# Altium project PCB_DC_Motor_Drive.PrjPCB
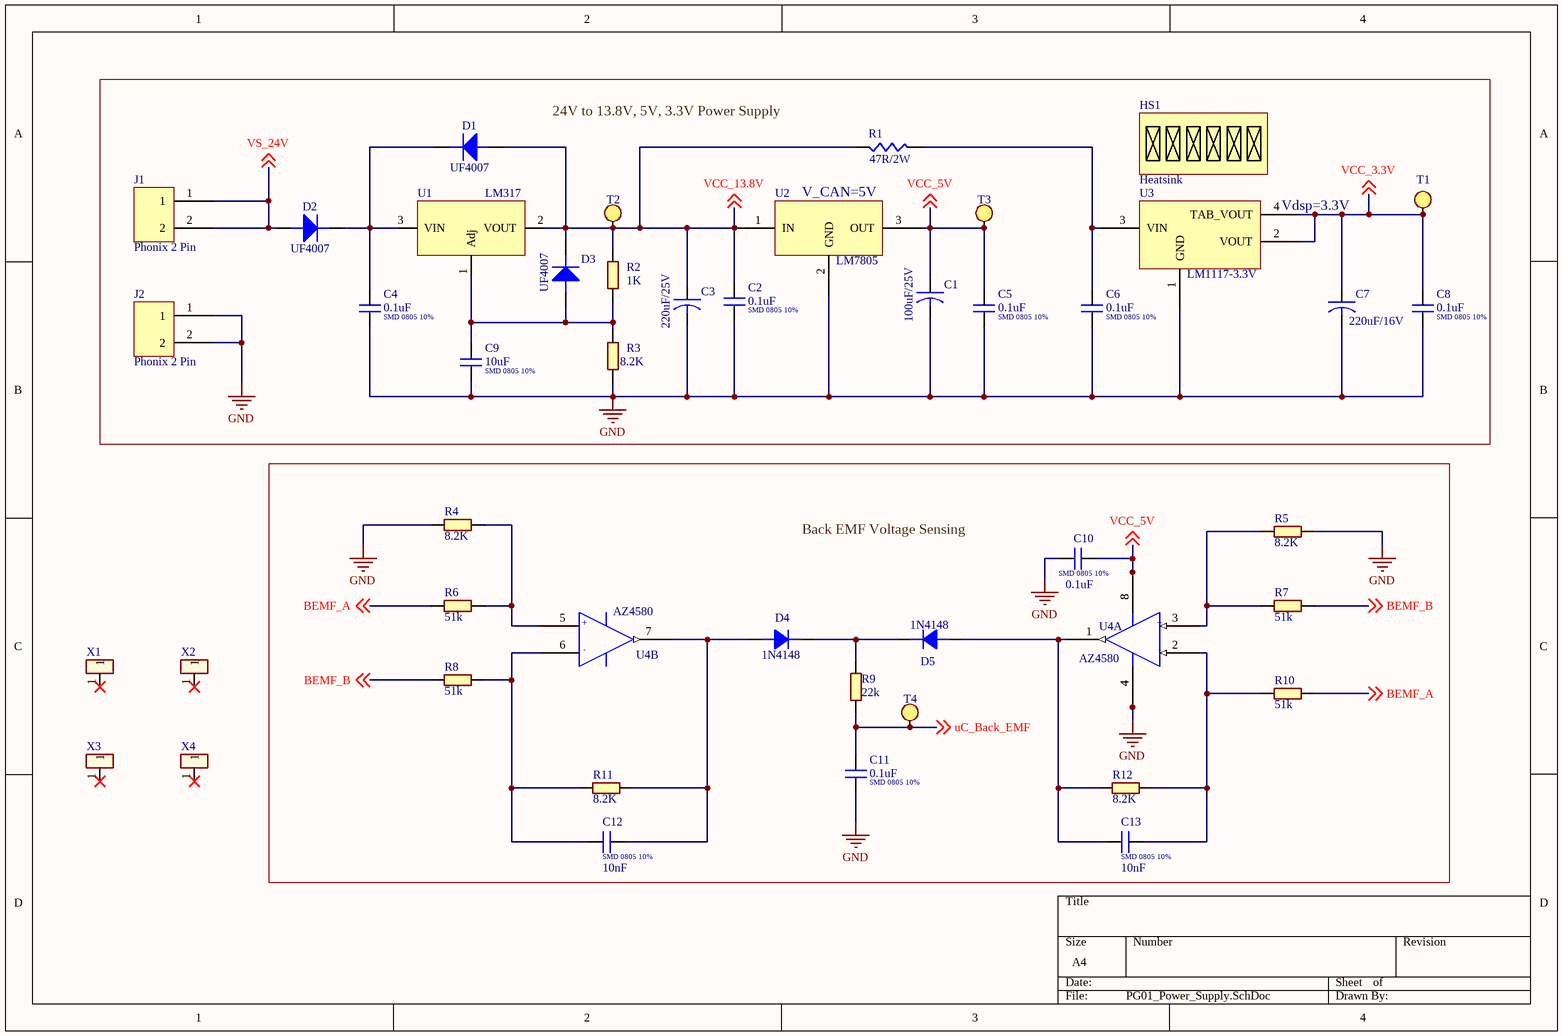
[diagram p0: PG01_Power_Supply.SchDoc]
5 sheets, 242 parts. Net scope: global (net labels, ports and power ports of the same name join across sheets).
Board file: PCB_DCMotor.PcbDoc
Sheets:
  PG01_Power_Supply.SchDoc
  PG02_Full_Bridge.SchDoc
  PG03_Analog_Digital_Inputs.SchDoc
  PG04_Communications.SchDoc
  PG05_DSP_Circuit.SchDoc

## Sheet PG01_Power_Supply.SchDoc
size A4

### Parts
C1  value 100uF/25V  [CAP 5MM]  (hidden comment: Electrolyte Cap)
C2  SMD 0805 10%  value 0.1uF  [SMD0805]
C3  value 220uF/25V  [CAP_8mm]  (hidden comment: Electrolyte Cap)
C4  SMD 0805 10%  value 0.1uF  [SMD0805]
C5  SMD 0805 10%  value 0.1uF  [SMD0805]
C6  SMD 0805 10%  value 0.1uF  [SMD0805]
C7  value 220uF/16V  [CAP_8mm]  (hidden comment: Electrolyte Cap)
C8  SMD 0805 10%  value 0.1uF  [SMD0805]
C9  SMD 0805 10%  value 10uF  [SMD0805]
C10  SMD 0805 10%  value 0.1uF  [SMD0805]
C11  SMD 0805 10%  value 0.1uF  [SMD0805]
C12  SMD 0805 10%  value 10nF  [SMD0805]
C13  SMD 0805 10%  value 10nF  [SMD0805]
D1  value UF4007  [DO-214(SMA)]  (hidden comment: Diode SMA)
D2  value UF4007  [DO-214(SMA)]  (hidden comment: Diode SMA)
D3  value UF4007  [DO-214(SMA)]  (hidden comment: Diode SMA)
D4  1N4148  [SOD-80]
D5  1N4148  [SOD-80]
HS1  Heatsink  [Heatsink_25mm]
J1  Phonix 2 Pin  [PHONIX2]
J2  Phonix 2 Pin  [PHONIX2]
R1  value 47R/2W  [Axial_2W_Vert]  (hidden comment: Series Resistor)
R2  value 1K  [SMD1206]  (hidden comment: SMD 1206 1%)
R3  value 8.2K  [SMD1206]  (hidden comment: SMD 1206 1%)
R4  value 8.2K  [SMD1206]  (hidden comment: SMD 1206 1%)
R5  value 8.2K  [SMD1206]  (hidden comment: SMD 1206 1%)
R6  value 51k  [SMD1206]  (hidden comment: SMD 1206 1%)
R7  value 51k  [SMD1206]  (hidden comment: SMD 1206 1%)
R8  value 51k  [SMD1206]  (hidden comment: SMD 1206 1%)
R9  value 22k  [SMD1206]  (hidden comment: SMD 1206 1%)
R10  value 51k  [SMD1206]  (hidden comment: SMD 1206 1%)
R11  value 8.2K  [SMD1206]  (hidden comment: SMD 1206 1%)
R12  value 8.2K  [SMD1206]  (hidden comment: SMD 1206 1%)
T1  Through hole TestPoint  [TP]  (value not drawn)
T2  Through hole TestPoint  [TP]  (value not drawn)
T3  Through hole TestPoint  [TP]  (value not drawn)
T4  Through hole TestPoint  [TP]  (value not drawn)
U1  LM317  [TO220_Normal]
U2  LM7805  [TO220_Normal]
U3  value LM1117-3.3V  [SOT-223]  (hidden comment: 3.3V Regulator)
U4  value AZ4580  [SOIC-8]  (hidden comment: LM358)  (parts A,B of 2)
X1  TP  [Screw]  (value not drawn)
X2  TP  [Screw]  (value not drawn)
X3  TP  [Screw]  (value not drawn)
X4  TP  [Screw]  (value not drawn)

### Blocks framed on the sheet
Back EMF Voltage Sensing: C10-C13 D4 D5 R4-R12 T4 U4

### Nets
GND: C1.2 C2.2 C3.2 C4.2 C5.2 C6.2 C7.2 C8.2 C9.2 C10.1 C11.2 J2.1 J2.2 R3.1 R4.2 R5.1 U2.2(GND) U3.1(GND) U4.4(GND)
BEMF_A: R6.2 R10.1 ; off-sheet BEMF_A
BEMF_B: R7.1 R8.2 ; off-sheet BEMF_B
uC_Back_EMF: C11.1 R9.2 T4.1 ; off-sheet uC_Back_EMF
VCC_3.3V: C7.1 C8.1 T1.1 U3.2(VOUT) U3.4(TAB_VOUT) ; off-sheet VCC_3.3V
VCC_5V: C1.1 C5.1 C10.2 T3.1 U2.3(OUT) U4.8(VCC) ; off-sheet VCC_5V
VCC_13.8V: C2.1 C3.1 D1.1 D3.2 R1.1 R2.2 T2.1 U1.2(VOUT) U2.1(IN) ; off-sheet VCC_13.8V
VS_24V: D2.1 J1.1 J1.2 ; off-sheet VS_24V
NetC4_1: C4.1 D1.2 D2.2 U1.3(VIN)
NetC6_1: C6.1 R1.2 U3.3(VIN)
NetC9_1: C9.1 D3.1 R2.1 R3.2 U1.1(Adj)
NetC12_1: C12.1 D4.1(ANODE) R11.1 U4.7(OUT)
NetC12_2: C12.2 R8.1 R11.2 U4.6(-IN)
NetC13_1: C13.1 R10.2 R12.1 U4.2(-IN)
NetC13_2: C13.2 D5.1(ANODE) R12.2 U4.1(OUT)
NetD4_2: D4.2(CATHODE) D5.2(CATHODE) R9.1
NetR4_1: R4.1 R6.1 U4.5(+IN)
NetR5_2: R5.2 R7.2 U4.3(+IN)

Not connected (* = marked no-connect by the designer): X1 1*; X2 1*; X3 1*; X4 1*

### Notes on the sheet
- 24V to 13.8V, 5V, 3.3V Power Supply
- V_CAN=5V
- (near U3) Vdsp=3.3V
- (in symbol LM358, part A) +; -
- (in symbol LM358, part B) +; -

### Library data of the parts
C1 C3 C7 = CAP
C2 C4-C6 C8-C13 = CAP_SMD: Manufacturer: Vishay
D1-D3 = Diode_SMA: Manufacturer: Diodes Corp
D4 D5 = 1N4148: Part No.: SM4007; Manufacturer: Vishay; Source Of Supply: Rajiv Electronics,Pune; Type: Component; Temp. Range: -65 to 150 Deg. Cel.; Tolerance: 10%; Rating: -; Temp. Coeff.: -; Termination: -; Marking: -; Category: Diode
HS1 = HS_15W: Value: Heatsink
J1 J2 = Phonix_2_Pin
R1 = RES_TH: Manufacturer: *
R2-R12 = RES_SMD: Manufacturer: Vishay; Description: SMD1206  1% Resistor
T1-T4 = TestPoint_TH: Value: TP
U3 = LM1117
U4 = LM358: Manufacturer: ST Semiconductor
X1-X4 = TEST POINT_0: Temp. Range: -40 to 85 Deg. Cel.; Tolerance: -; Temp. Coeff.: -; Category: Test Point; Rating: -; Termination: -; Marking: -; Manufacturer: -
U1 = LM317: Value: LM317
U2 = LM7805: Value: LM7805

## Sheet PG02_Full_Bridge.SchDoc
size A3
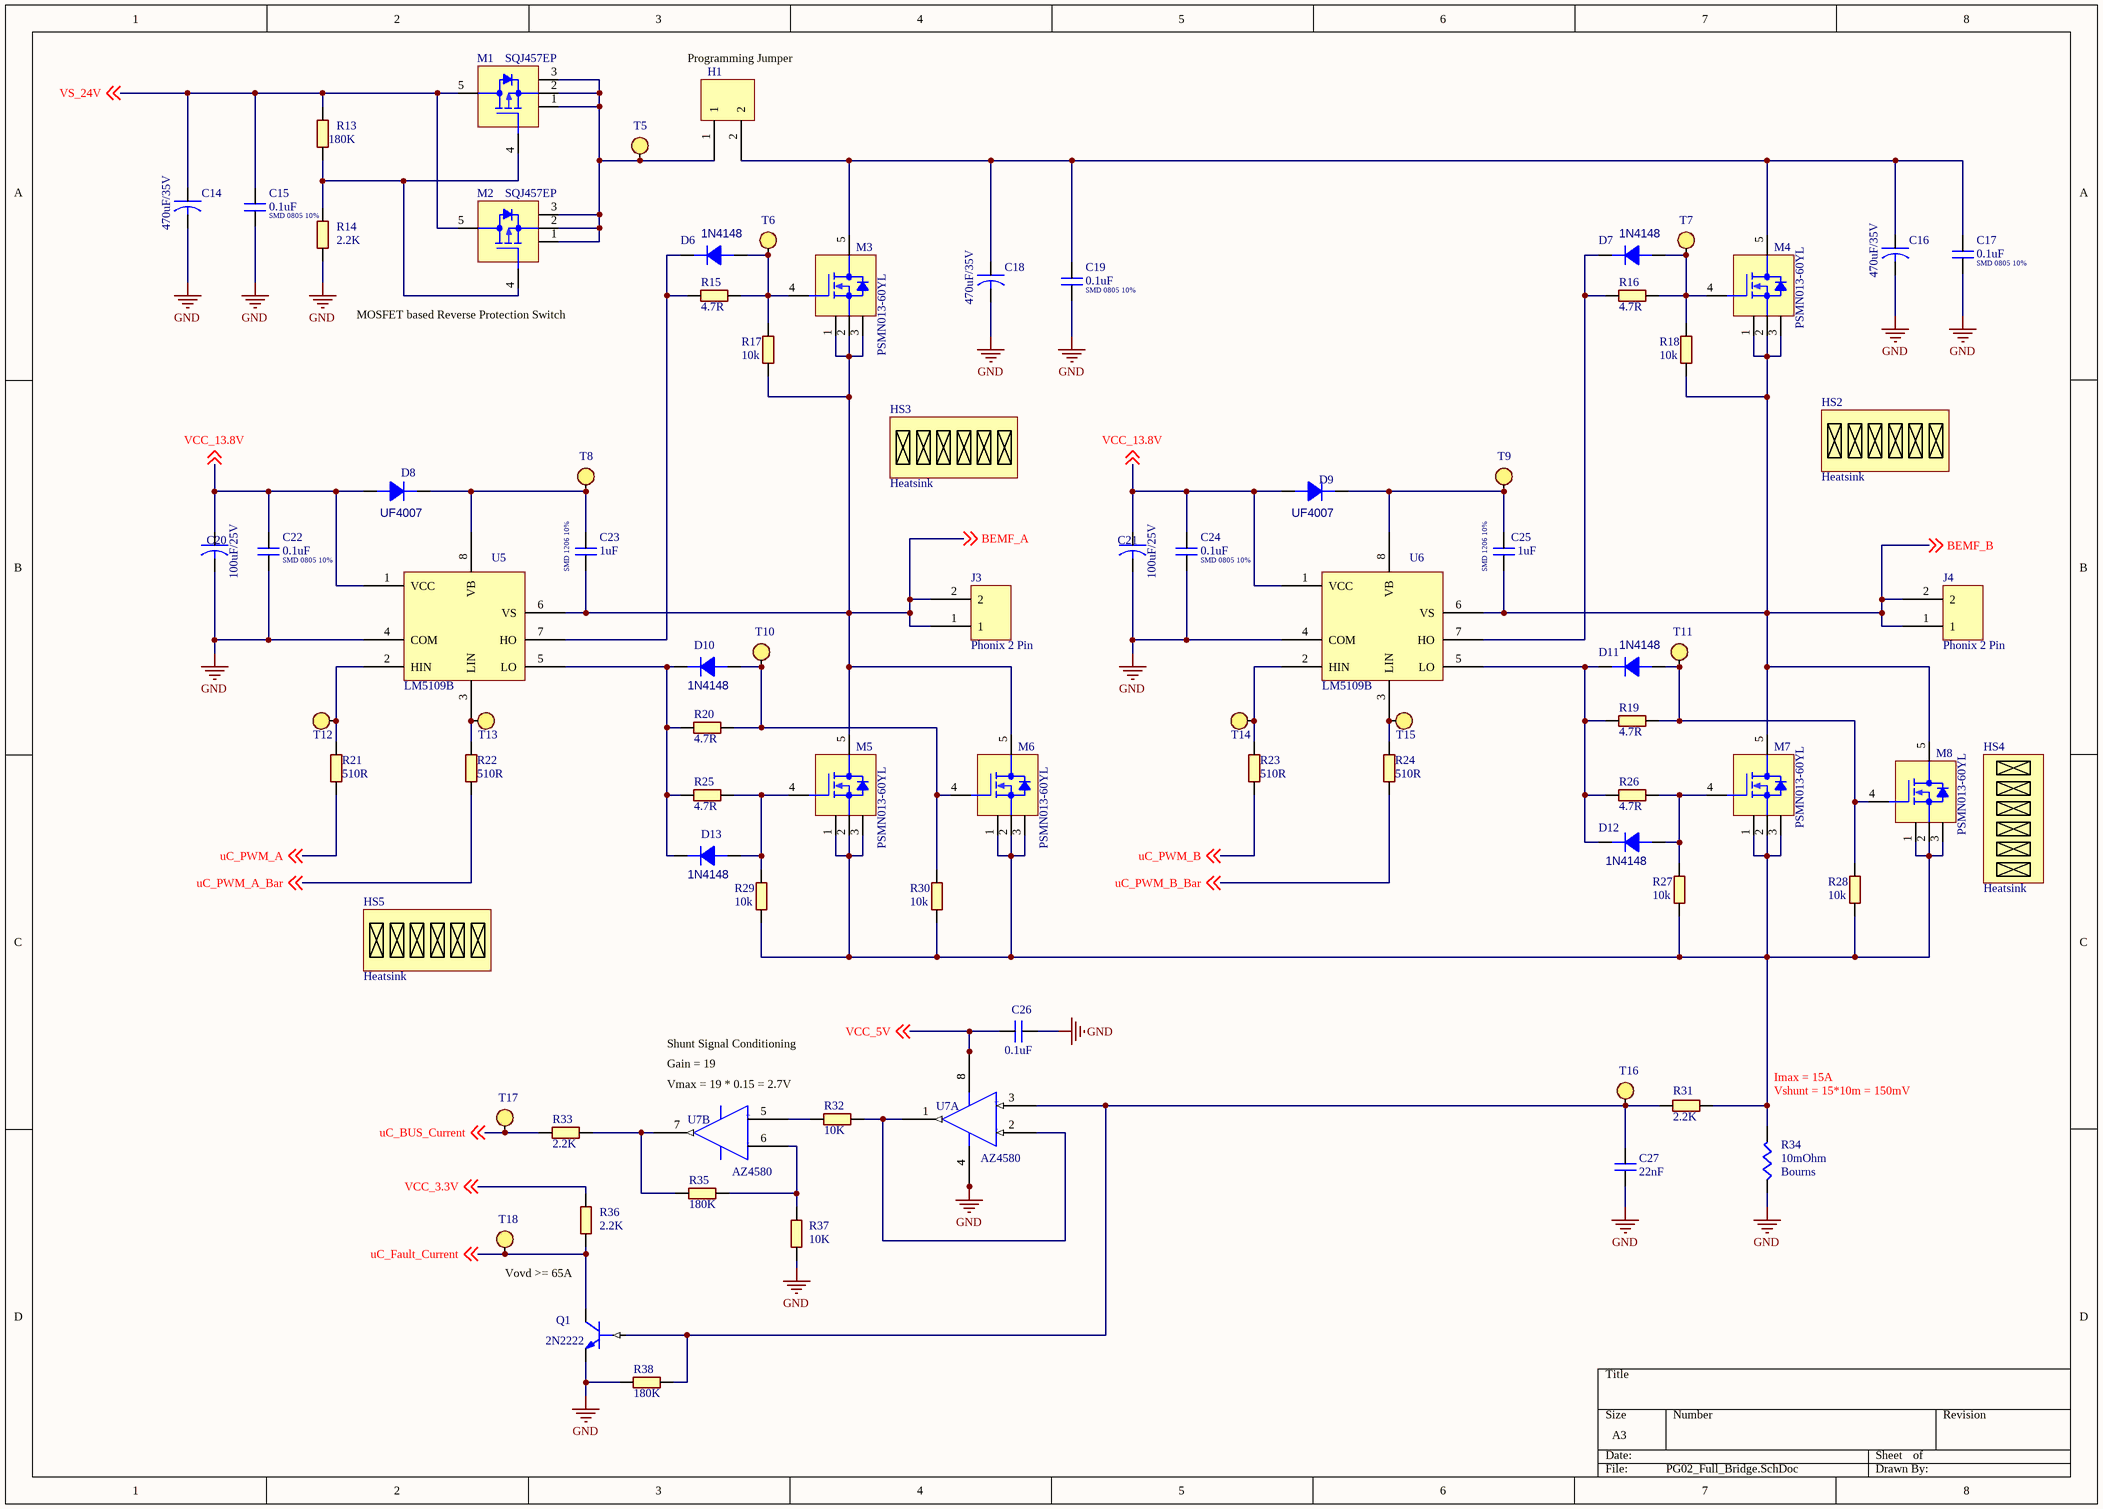
[diagram p1: PG02_Full_Bridge.SchDoc]

### Parts
C14  value 470uF/35V  [CAP 10MM DIA]  (hidden comment: Electrolyte Cap)
C15  SMD 0805 10%  value 0.1uF  [SMD0805]
C16  value 470uF/35V  [CAP 10MM DIA]  (hidden comment: Electrolyte Cap)
C17  SMD 0805 10%  value 0.1uF  [SMD0805]
C18  value 470uF/35V  [CAP 10MM DIA]  (hidden comment: Electrolyte Cap)
C19  SMD 0805 10%  value 0.1uF  [SMD0805]
C20  100uF/25V  [CAP 5MM]
C21  100uF/25V  [CAP 5MM]
C22  SMD 0805 10%  value 0.1uF  [SMD0805]
C23  SMD 1206 10%  value 1uF  [SMD1206]
C24  SMD 0805 10%  value 0.1uF  [SMD0805]
C25  SMD 1206 10%  value 1uF  [SMD1206]
C26  value 0.1uF  [SMD0805]  (hidden comment: SMD 0805 10%)
C27  value 22nF  [SMD0805]  (hidden comment: SMD 0805 10%)
D6  1N4148  [SOD-80]
D7  1N4148  [SOD-80]
D8  UF4007  [DO-214(SMA)]
D9  UF4007  [DO-214(SMA)]
D10  1N4148  [SOD-80]
D11  1N4148  [SOD-80]
D12  1N4148  [SOD-80]
D13  1N4148  [SOD-80]
H1  Header 2 pin  [Header-2-Pin]  (value not drawn)
HS2  Heatsink  [Heatsink_25mm]
HS3  Heatsink  [Heatsink_25mm]
HS4  Heatsink  [Heatsink_25mm]
HS5  Heatsink  [Heatsink_25mm]
J3  Phonix 2 Pin  [PHONIX2]
J4  Phonix 2 Pin  [PHONIX2]
M1  value SQJ457EP  [SO8-L]  (hidden comment: P MOSFET)
M2  value SQJ457EP  [SO8-L]  (hidden comment: P MOSFET)
M3  value PSMN013-60YL  [SO8-L]  (hidden comment: N MOSFET)
M4  value PSMN013-60YL  [SO8-L]  (hidden comment: N MOSFET)
M5  value PSMN013-60YL  [SO8-L]  (hidden comment: N MOSFET)
M6  value PSMN013-60YL  [SO8-L]  (hidden comment: N MOSFET)
M7  value PSMN013-60YL  [SO8-L]  (hidden comment: N MOSFET)
M8  value PSMN013-60YL  [SO8-L]  (hidden comment: N MOSFET)
Q1  value 2N2222  [SOT23-3-Leads]  (hidden comment: NPN Transistor)
R13  value 180K  [SMD1206]  (hidden comment: SMD 1206 1%)
R14  value 2.2K  [SMD1206]  (hidden comment: SMD 1206 1%)
R15  value 4.7R  [SMD1206]  (hidden comment: SMD 1206 1%)
R16  value 4.7R  [SMD1206]  (hidden comment: SMD 1206 1%)
R17  value 10k  [SMD1206]  (hidden comment: SMD 1206 1%)
R18  value 10k  [SMD1206]  (hidden comment: SMD 1206 1%)
R19  value 4.7R  [SMD1206]  (hidden comment: SMD 1206 1%)
R20  value 4.7R  [SMD1206]  (hidden comment: SMD 1206 1%)
R21  value 510R  [SMD1206]  (hidden comment: SMD 1206 1%)
R22  value 510R  [SMD1206]  (hidden comment: SMD 1206 1%)
R23  value 510R  [SMD1206]  (hidden comment: SMD 1206 1%)
R24  value 510R  [SMD1206]  (hidden comment: SMD 1206 1%)
R25  value 4.7R  [SMD1206]  (hidden comment: SMD 1206 1%)
R26  value 4.7R  [SMD1206]  (hidden comment: SMD 1206 1%)
R27  value 10k  [SMD1206]  (hidden comment: SMD 1206 1%)
R28  value 10k  [SMD1206]  (hidden comment: SMD 1206 1%)
R29  value 10k  [SMD1206]  (hidden comment: SMD 1206 1%)
R30  value 10k  [SMD1206]  (hidden comment: SMD 1206 1%)
R31  value 2.2K  [SMD1206]  (hidden comment: SMD 1206 1%)
R32  value 10K  [SMD1206]  (hidden comment: SMD 1206 1%)
R33  value 2.2K  [SMD1206]  (hidden comment: SMD 1206 1%)
R34  value 10mOhm  Manufacturer: Bourns  [SMD2512]  (hidden comment: CRA2512)
R35  value 180K  [SMD1206]  (hidden comment: SMD 1206 1%)
R36  value 2.2K  [SMD1206]  (hidden comment: SMD 1206 1%)
R37  value 10K  [SMD1206]  (hidden comment: SMD 1206 1%)
R38  value 180K  [SMD1206]  (hidden comment: SMD 1206 1%)
T5  Through hole TestPoint  [TP]  (value not drawn)
T6  Through hole TestPoint  [TP]  (value not drawn)
T7  Through hole TestPoint  [TP]  (value not drawn)
T8  Through hole TestPoint  [TP]  (value not drawn)
T9  Through hole TestPoint  [TP]  (value not drawn)
T10  Through hole TestPoint  [TP]  (value not drawn)
T11  Through hole TestPoint  [TP]  (value not drawn)
T12  Through hole TestPoint  [TP]  (value not drawn)
T13  Through hole TestPoint  [TP]  (value not drawn)
T14  Through hole TestPoint  [TP]  (value not drawn)
T15  Through hole TestPoint  [TP]  (value not drawn)
T16  Through hole TestPoint  [TP]  (value not drawn)
T17  Through hole TestPoint  [TP]  (value not drawn)
T18  Through hole TestPoint  [TP]  (value not drawn)
U5  LM5109B  [SOIC-8]
U6  LM5109B  [SOIC-8]
U7  value AZ4580  [SOIC-8]  (hidden comment: LM358)  (parts A,B of 2)

### Nets
GND: C14.2 C15.2 C16.2 C17.2 C18.2 C19.2 C20.2 C21.2 C22.2 C24.2 C26.2 C27.2 Q1.2(EMITTER) R14.2 R34.1 R37.1 R38.1 U5.4(COM) U6.4(COM) U7.4(GND)
BEMF_A: C23.2 J3.1 J3.2 M3.1 M3.2 M3.3 M5.5 M6.5 R17.1 U5.6(VS) ; off-sheet BEMF_A
BEMF_B: C25.2 J4.1 J4.2 M4.1 M4.2 M4.3 M7.5 M8.5 R18.1 U6.6(VS) ; off-sheet BEMF_B
uC_BUS_Current: R33.1 T17.1 ; off-sheet uC_BUS_Current
uC_Fault_Current: Q1.3(COLLECTOR) R36.1 T18.1 ; off-sheet uC_Fault_Current
uC_PWM_A: R21.2 ; off-sheet uC_PWM_A
uC_PWM_A_Bar: R22.2 ; off-sheet uC_PWM_A_Bar
uC_PWM_B: R23.2 ; off-sheet uC_PWM_B
uC_PWM_B_Bar: R24.2 ; off-sheet uC_PWM_B_Bar
VCC_3.3V: R36.2 ; off-sheet VCC_3.3V
VCC_5V: C26.1 U7.8(VCC) ; off-sheet VCC_5V
VCC_13.8V: C20.1 C21.1 C22.1 C24.1 D8.1(ANODE) D9.1(ANODE) U5.1(VCC) U6.1(VCC) ; off-sheet VCC_13.8V
VS_24V: C14.1 C15.1 M1.5 M2.5 R13.1 ; off-sheet VS_24V
NetC16_1: C16.1 C17.1 C18.1 C19.1 H1.2 M3.5 M4.5
NetC23_1: C23.1 D8.2(CATHODE) T8.1 U5.8(VB)
NetC25_1: C25.1 D9.2(CATHODE) T9.1 U6.8(VB)
NetC27_1: C27.1 Q1.1(BASE) R31.1 R38.2 T16.1 U7.3(+IN)
NetD6_1: D6.1(ANODE) M3.4(G) R15.1 R17.2 T6.1
NetD6_2: D6.2(CATHODE) R15.2 U5.7(HO)
NetD7_1: D7.1(ANODE) M4.4(G) R16.1 R18.2 T7.1
NetD7_2: D7.2(CATHODE) R16.2 U6.7(HO)
NetD10_1: D10.1(ANODE) M6.4(G) R20.2 R30.2 T10.1
NetD10_2: D10.2(CATHODE) D13.2(CATHODE) R20.1 R25.2 U5.5(LO)
NetD11_1: D11.1(ANODE) M8.4(G) R19.1 R28.2 T11.1
NetD11_2: D11.2(CATHODE) D12.2(CATHODE) R19.2 R26.2 U6.5(LO)
NetD12_1: D12.1(ANODE) M7.4(G) R26.1 R27.2
NetD13_1: D13.1(ANODE) M5.4(G) R25.1 R29.2
NetH1_1: H1.1 M1.1 M1.2 M1.3 M2.1 M2.2 M2.3 T5.1
NetM1_4: M1.4(G) M2.4(G) R13.2 R14.1
NetM5_1: M5.1 M5.2 M5.3 M6.1 M6.2 M6.3 M7.1 M7.2 M7.3 M8.1 M8.2 M8.3 R27.1 R28.1 R29.1 R30.1 R31.2 R34.2
NetR21_1: R21.1 T12.1 U5.2(HIN)
NetR22_1: R22.1 T13.1 U5.3(LIN)
NetR23_1: R23.1 T14.1 U6.2(HIN)
NetR24_1: R24.1 T15.1 U6.3(LIN)
NetR32_1: R32.1 U7.5(+IN)
NetR32_2: R32.2 U7.1(OUT) U7.2(-IN)
NetR33_2: R33.2 R35.1 U7.7(OUT)
NetR35_2: R35.2 R37.2 U7.6(-IN)

### Notes on the sheet
- Programming Jumper
- (near M2) MOSFET based Reverse Protection Switch
- Shunt Signal Conditioning
- (near U7) Gain = 19
- Vmax = 19 * 0.15 = 2.7V
- Imax = 15A
- (near R34) Vshunt = 15*10m = 150mV
- (near T18) Vovd >= 65A
- (in symbol LM358, part A) +; -
- (in symbol LM358, part B) +; -

### Library data of the parts
C14 C16 C18 C20 C21 = CAP
C15 C17 C19 C22-C27 = CAP_SMD: Manufacturer: Vishay
D6-D13 = 1N4148: as D4 on sheet PG01_Power_Supply; Rating: -; Temp. Coeff.: -; Termination: -; Marking: -; Category: Diode
H1 = Header_2_Pin: Manufaturer: Rajeev; Value: 2 pin Relimate Male Header
HS2-HS5 = HS_15W: Value: Heatsink
J3 J4 = Phonix_2_Pin
M1 M2 = PMOS_SQJ457EP: Manufacturer: Vishay
M3-M8 = MOS_PSMN013-60YL: Manufacturer: NxP
Q1 = 2N3904_1: Manufacturer: OnSemi
R13-R33 R35-R38 = RES_SMD: as R2 on sheet PG01_Power_Supply
R34 = RES_TH
T5-T18 = TestPoint_TH: Value: TP
U5 U6 = IR2106
U7 = LM358: Manufacturer: ST Semiconductor

## Sheet PG03_Analog_Digital_Inputs.SchDoc
size A3
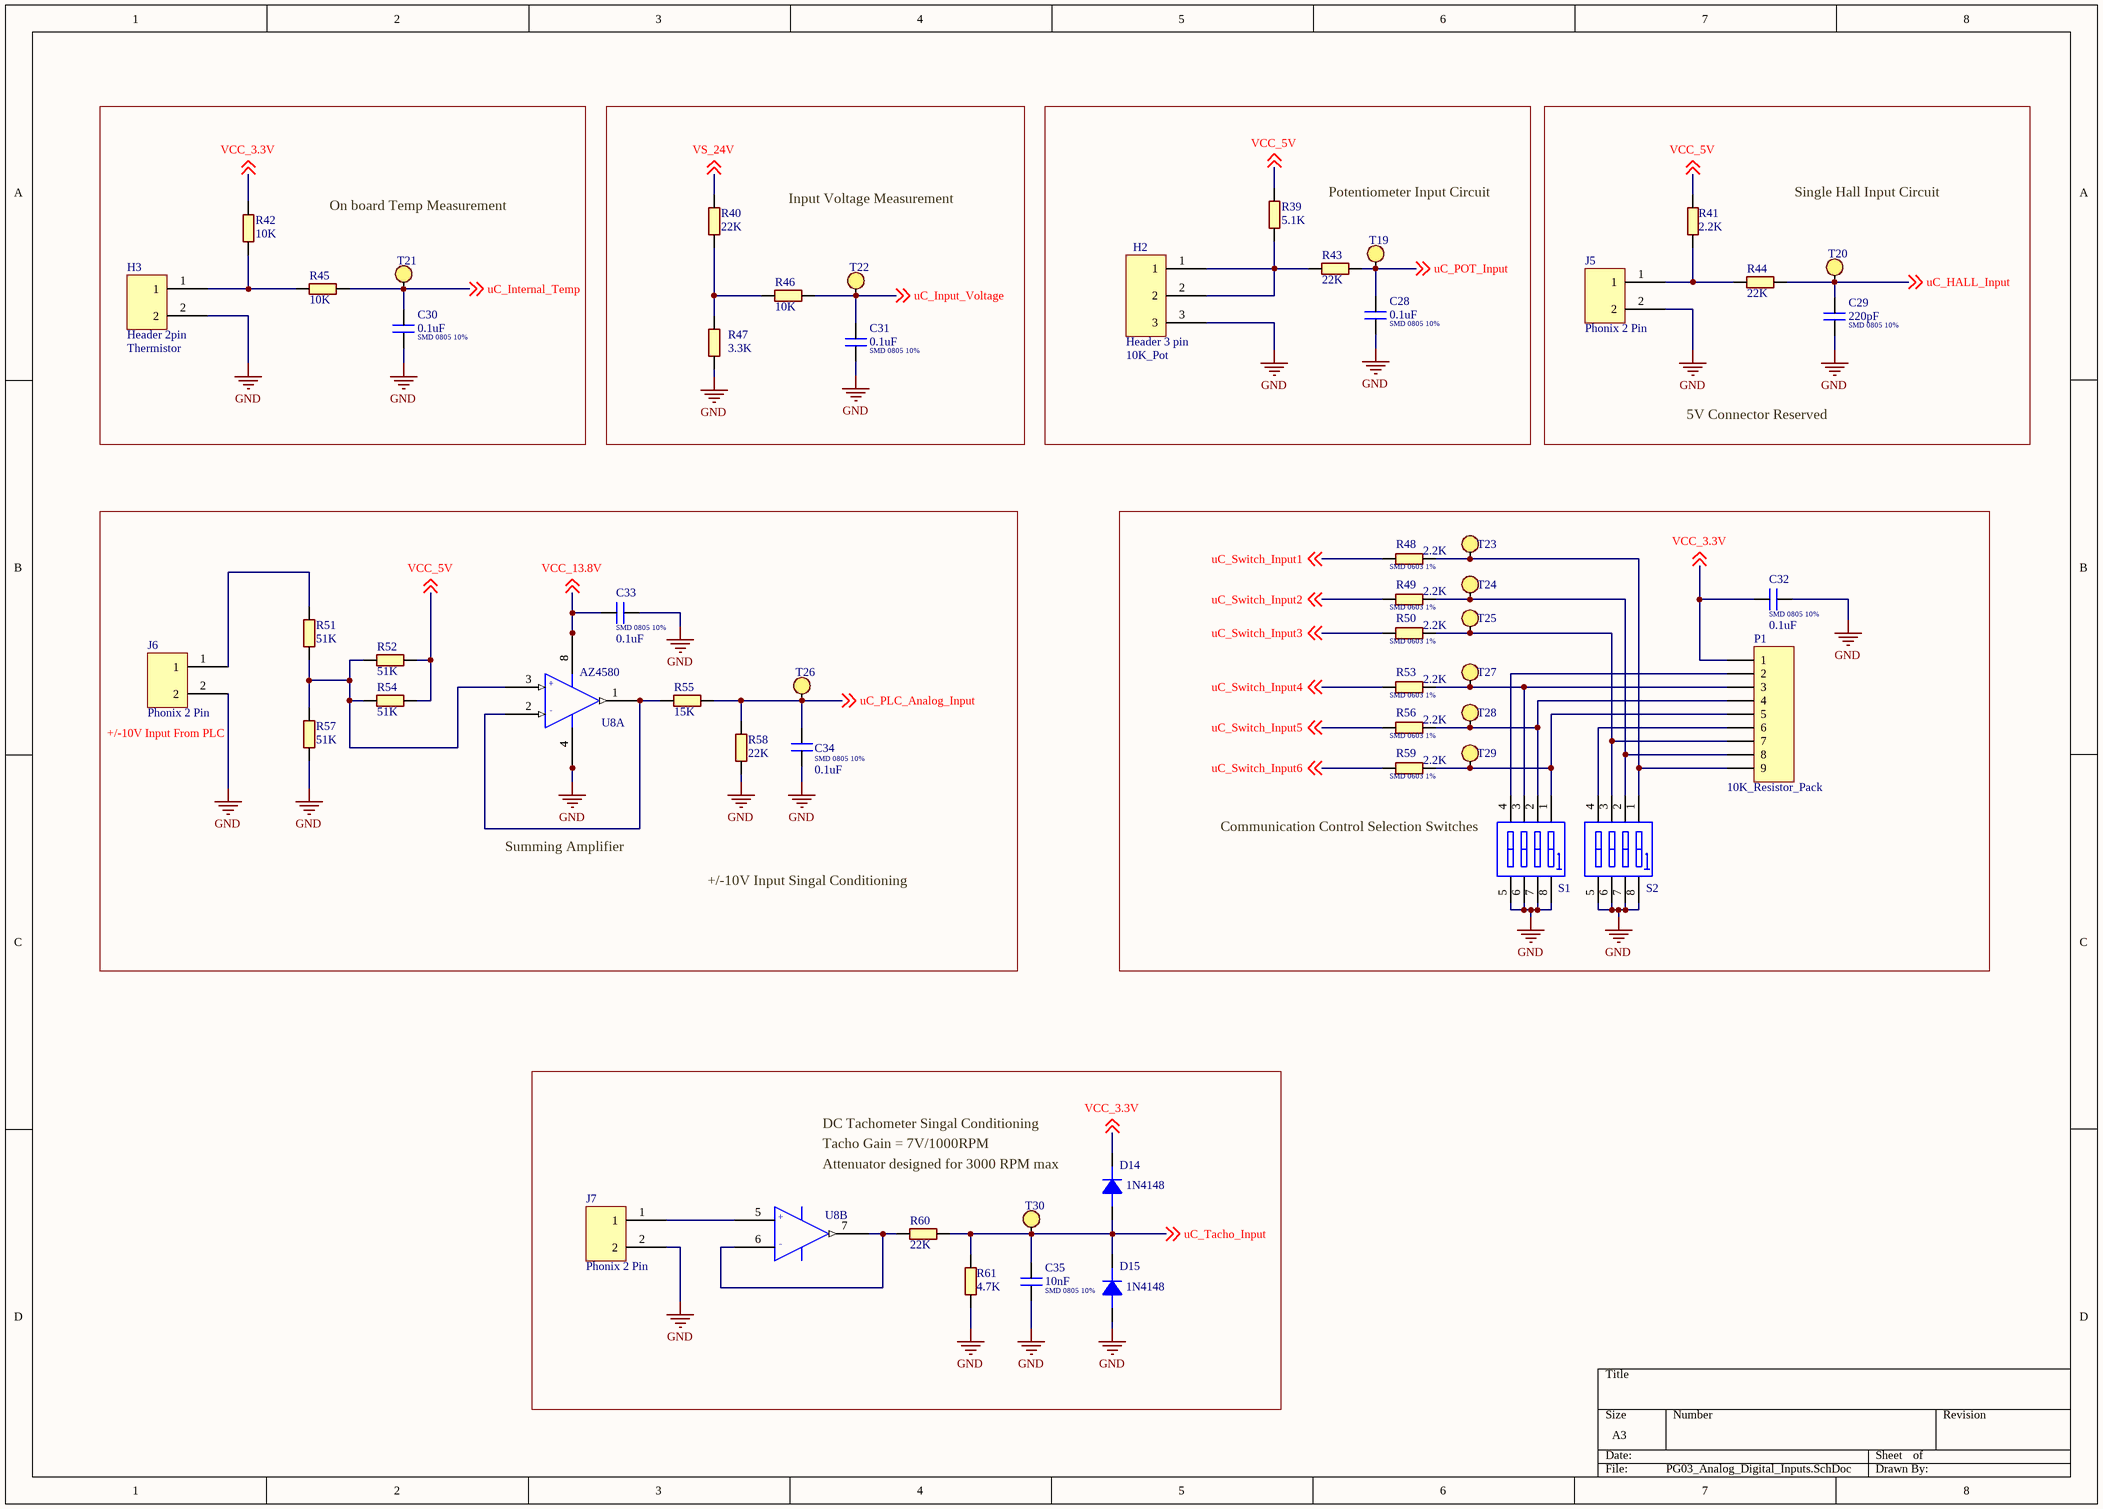
[diagram p2: PG03_Analog_Digital_Inputs.SchDoc]

### Parts
C28  SMD 0805 10%  value 0.1uF  [SMD0805]
C29  SMD 0805 10%  value 220pF  [SMD0805]
C30  SMD 0805 10%  value 0.1uF  [SMD0805]
C31  SMD 0805 10%  value 0.1uF  [SMD0805]
C32  SMD 0805 10%  value 0.1uF  [SMD0805]
C33  SMD 0805 10%  value 0.1uF  [SMD0805]
C34  SMD 0805 10%  value 0.1uF  [SMD0805]
C35  SMD 0805 10%  value 10nF  [SMD0805]
D14  1N4148  [SOD-80]
D15  1N4148  [SOD-80]
H2  10K_Pot  value Header 3 pin  [Header-3-Pin]
H3  Thermistor  value Header 2pin  [Header-2-Pin]
J5  Phonix 2 Pin  [PHONIX2]
J6  Phonix 2 Pin  [PHONIX2]
J7  Phonix 2 Pin  [PHONIX2]
P1  10K_Resistor_Pack  [HDR1X9]
R39  value 5.1K  [SMD1206]  (hidden comment: SMD 1206 1%)
R40  value 22K  [SMD1206]  (hidden comment: SMD 1206 1%)
R41  value 2.2K  [SMD1206]  (hidden comment: SMD 1206 1%)
R42  value 10K  [SMD1206]  (hidden comment: SMD 1206 1%)
R43  value 22K  [SMD1206]  (hidden comment: SMD 1206 1%)
R44  value 22K  [SMD1206]  (hidden comment: SMD 1206 1%)
R45  value 10K  [SMD1206]  (hidden comment: SMD 1206 1%)
R46  value 10K  [SMD1206]  (hidden comment: SMD 1206 1%)
R47  value 3.3K  [SMD1206]  (hidden comment: SMD 1206 1%)
R48  SMD 0603 1%  value 2.2K  [SMD0603]
R49  SMD 0603 1%  value 2.2K  [SMD0603]
R50  SMD 0603 1%  value 2.2K  [SMD0603]
R51  value 51K  [SMD1206]  (hidden comment: SMD 1206 1%)
R52  value 51K  [SMD1206]  (hidden comment: SMD 1206 1%)
R53  SMD 0603 1%  value 2.2K  [SMD0603]
R54  value 51K  [SMD1206]  (hidden comment: SMD 1206 1%)
R55  value 15K  [SMD1206]  (hidden comment: SMD 1206 1%)
R56  SMD 0603 1%  value 2.2K  [SMD0603]
R57  value 51K  [SMD1206]  (hidden comment: SMD 1206 1%)
R58  value 22K  [SMD1206]  (hidden comment: SMD 1206 1%)
R59  SMD 0603 1%  value 2.2K  [SMD0603]
R60  value 22K  [SMD1206]  (hidden comment: SMD 1206 1%)
R61  value 4.7K  [SMD1206]  (hidden comment: SMD 1206 1%)
S1  2.54mm DIP-4 SMD  [DIP8]  (value not drawn)
S2  2.54mm DIP-4 SMD  [DIP8]  (value not drawn)
T19  Through hole TestPoint  [TP]  (value not drawn)
T20  Through hole TestPoint  [TP]  (value not drawn)
T21  Through hole TestPoint  [TP]  (value not drawn)
T22  Through hole TestPoint  [TP]  (value not drawn)
T23  Through hole TestPoint  [TP]  (value not drawn)
T24  Through hole TestPoint  [TP]  (value not drawn)
T25  Through hole TestPoint  [TP]  (value not drawn)
T26  Through hole TestPoint  [TP]  (value not drawn)
T27  Through hole TestPoint  [TP]  (value not drawn)
T28  Through hole TestPoint  [TP]  (value not drawn)
T29  Through hole TestPoint  [TP]  (value not drawn)
T30  Through hole TestPoint  [TP]  (value not drawn)
U8  value AZ4580  [SOIC-8]  (hidden comment: LM358)  (parts A,B of 2)

### Blocks framed on the sheet
On board Temp Measurement: C30 H3 R42 R45 T21
Input Voltage Measurement: C31 R40 R46 R47 T22
Potentiometer Input Circuit: C28 H2 R39 R43 T19
Communication Control Selection Switches: C32 P1 R48-R50 R53 R56 R59 S1 S2 T23-T25 T27-T29

### Nets
GND: C28.2 C29.2 C30.2 C31.2 C32.2 C33.2 C34.1 C35.2 D15.1(ANODE) H2.3 H3.2 J5.2 J6.2 J7.2 R47.2 R57.1 R58.1 R61.2 S1.5(B4) S1.6(B3) S1.7(B2) S1.8(B1) S2.5(B4) S2.6(B3) S2.7(B2) S2.8(B1) U8.4(GND)
uC_HALL_Input: C29.1 R44.1 T20.1 ; off-sheet uC_HALL_Input
uC_Input_Voltage: C31.1 R46.1 T22.1 ; off-sheet uC_Input_Voltage
uC_Internal_Temp: C30.1 R45.1 T21.1 ; off-sheet uC_Internal_Temp
uC_PLC_Analog_Input: C34.2 R55.1 R58.2 T26.1 ; off-sheet uC_PLC_Analog_Input
uC_POT_Input: C28.1 R43.1 T19.1 ; off-sheet uC_POT_Input
uC_Switch_Input1: R48.1 ; off-sheet uC_Switch_Input1
uC_Switch_Input2: R49.1 ; off-sheet uC_Switch_Input2
uC_Switch_Input3: R50.1 ; off-sheet uC_Switch_Input3
uC_Switch_Input4: R53.1 ; off-sheet uC_Switch_Input4
uC_Switch_Input5: R56.1 ; off-sheet uC_Switch_Input5
uC_Switch_Input6: R59.1 ; off-sheet uC_Switch_Input6
uC_Tacho_Input: C35.1 D14.1(ANODE) D15.2(CATHODE) R60.1 R61.1 T30.1 ; off-sheet uC_Tacho_Input
VCC_3.3V: C32.1 D14.2(CATHODE) P1.1 R42.2 ; off-sheet VCC_3.3V
VCC_5V: R39.2 R41.1 R52.1 R54.1 ; off-sheet VCC_5V
VCC_13.8V: C33.1 U8.8(VCC) ; off-sheet VCC_13.8V
VS_24V: R40.2 ; off-sheet VS_24V
NetH2_1: H2.1 H2.2 R39.1 R43.2
NetH3_1: H3.1 R42.1 R45.2
NetJ5_1: J5.1 R41.2 R44.2
NetJ6_1: J6.1 R51.2
NetJ7_1: J7.1 U8.5(+IN)
NetP1_2: P1.2 S1.4(A4)
NetP1_3: P1.3 R53.2 S1.3(A3) T27.1
NetP1_4: P1.4 R56.2 S1.2(A2) T28.1
NetP1_5: P1.5 R59.2 S1.1(A1) T29.1
NetP1_6: P1.6 S2.4(A4)
NetP1_7: P1.7 R50.2 S2.3(A3) T25.1
NetP1_8: P1.8 R49.2 S2.2(A2) T24.1
NetP1_9: P1.9 R48.2 S2.1(A1) T23.1
NetR40_1: R40.1 R46.2 R47.1
NetR51_1: R51.1 R52.2 R54.2 R57.2 U8.3(+IN)
NetR55_2: R55.2 U8.1(OUT) U8.2(-IN)
NetR60_2: R60.2 U8.6(-IN) U8.7(OUT)

### Notes on the sheet
- Single Hall Input Circuit
- 5V Connector Reserved
- (near J6) +/-10V Input From PLC
- Summing Amplifier
- +/-10V Input Singal Conditioning
- DC Tachometer Singal Conditioning
- Tacho Gain = 7V/1000RPM
- (near D14) Attenuator designed for 3000 RPM max
- (in symbol LM358, part A) +; -
- (in symbol LM358, part B) +; -

### Library data of the parts
C28-C35 = CAP_SMD: Manufacturer: Vishay
D14 D15 = 1N4148: as D4 on sheet PG01_Power_Supply; Rating: -; Temp. Coeff.: -; Termination: -; Marking: -; Category: Diode
H2 = Header_3_Pin
H3 = Header_2_Pin: Manufaturer: Rajeev
J5-J7 = Phonix_2_Pin
P1 = Header 9: Header, 9-Pin; LatestRevisionDate: 17-Jul-2002; LatestRevisionNote: Re-released for DXP Platform.; Publisher: Altium Limited
R39-R61 = RES_SMD: as R2 on sheet PG01_Power_Supply
S1 S2 = SW DIP-4: DIP Switch, 4 Position, SPST; Published: 24-Mar-1999; LatestRevisionDate: 17-Jul-2002; LatestRevisionNote: Re-released for DXP Platform.; PackageReference: SO8; Publisher: Altium Limited; Code_JEDEC: MS-012-AA; Code_IPC: SO8
T19-T30 = TestPoint_TH: Value: TP
U8 = LM358: Manufacturer: ST Semiconductor

## Sheet PG04_Communications.SchDoc
size A4
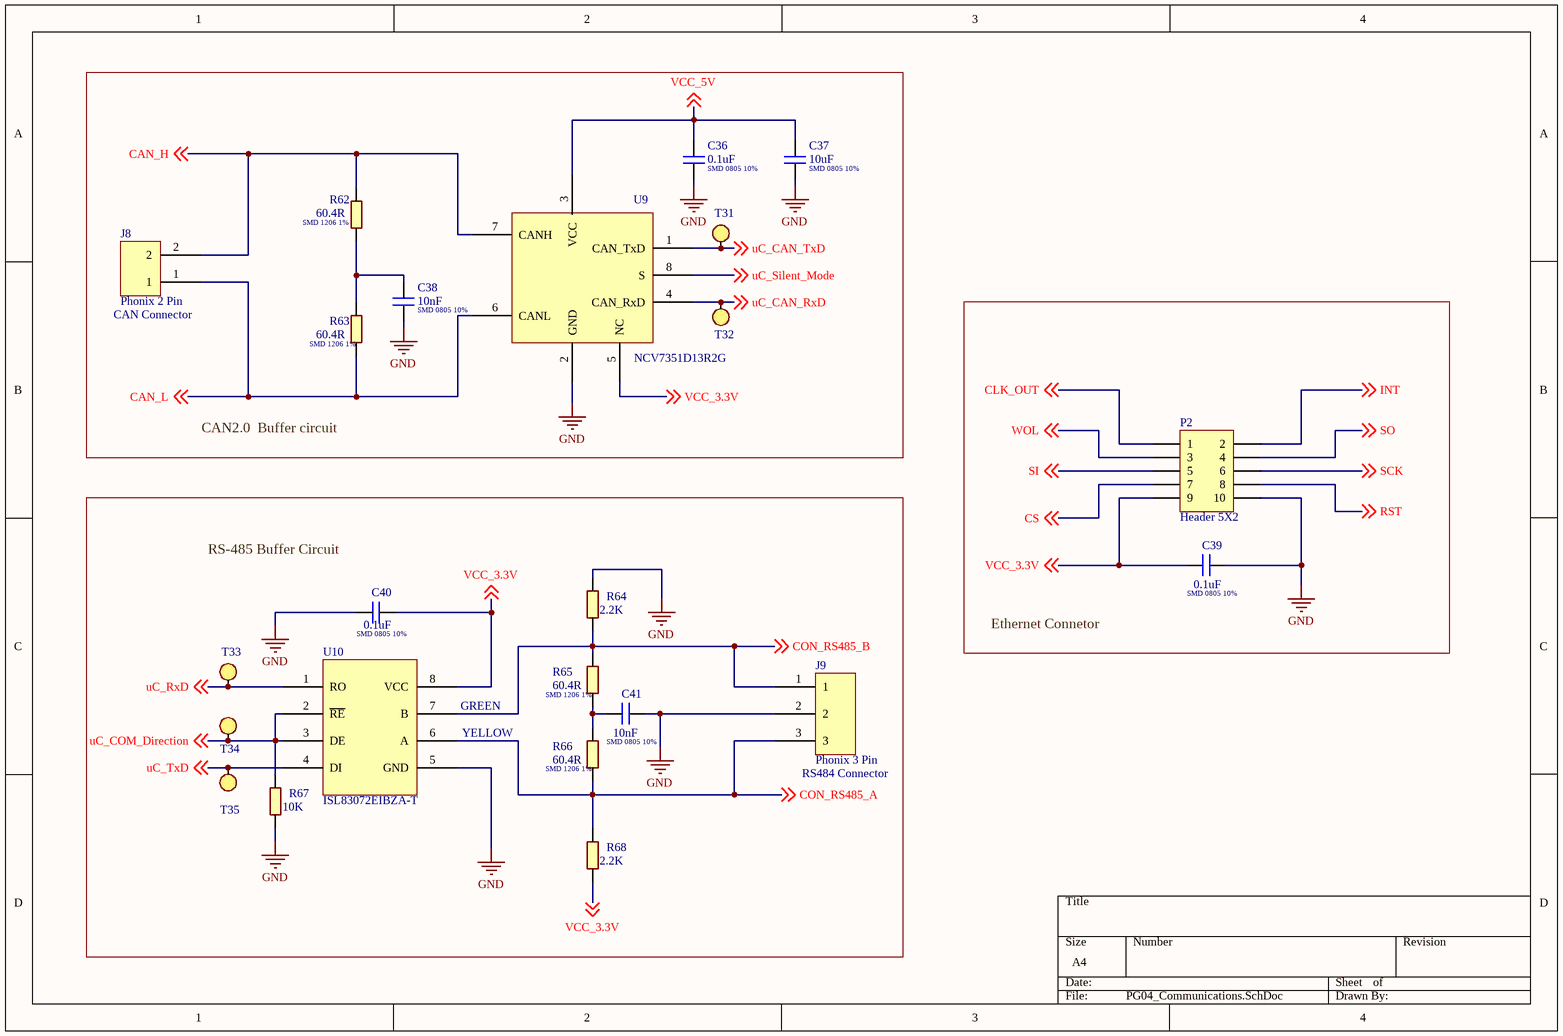
[diagram p3: PG04_Communications.SchDoc]

### Parts
C36  SMD 0805 10%  value 0.1uF  [SMD0805]
C37  SMD 0805 10%  value 10uF  [SMD0805]
C38  SMD 0805 10%  value 10nF  [SMD0805]
C39  SMD 0805 10%  value 0.1uF  [SMD0805]
C40  SMD 0805 10%  value 0.1uF  [SMD0805]
C41  SMD 0805 10%  value 10nF  [SMD0805]
J8  Phonix 2 Pin  [PHONIX2]
J9  Phonix 3 Pin  [Phonix_3]
P2  Header 5X2  [HDR2X5]
R62  SMD 1206 1%  value 60.4R  [SMD1206]
R63  SMD 1206 1%  value 60.4R  [SMD1206]
R64  value 2.2K  [SMD1206]  (hidden comment: SMD 1206 1%)
R65  SMD 1206 1%  value 60.4R  [SMD1206]
R66  SMD 1206 1%  value 60.4R  [SMD1206]
R67  value 10K  [SMD1206]  (hidden comment: SMD 1206 1%)
R68  value 2.2K  [SMD1206]  (hidden comment: SMD 1206 1%)
T31  Through hole TestPoint  [TP]  (value not drawn)
T32  Through hole TestPoint  [TP]  (value not drawn)
T33  Through hole TestPoint  [TP]  (value not drawn)
T34  Through hole TestPoint  [TP]  (value not drawn)
T35  Through hole TestPoint  [TP]  (value not drawn)
U9  value NCV7351D13R2G  [SOIC-8]  (hidden comment: CAN Transciver)
U10  value ISL83072EIBZA-T  [SOIC-8]  (hidden comment: MAX485)

### Blocks framed on the sheet
CAN2.0  Buffer circuit: C36-C38 J8 R62 R63 T31 T32 U9
Ethernet Connetor: C39 P2
RS-485 Buffer Circuit: C40 C41 J9 R64-R68 T33-T35 U10

### Nets
GND: C36.2 C37.2 C38.2 C39.2 C40.1 C41.2 J9.2 P2.10 R64.2 R67.1 U9.2(GND) U10.5(GND)
CAN_H: J8.2 R62.1 U9.7(CANH) ; off-sheet CAN_H
CAN_L: J8.1 R63.2 U9.6(CANL) ; off-sheet CAN_L
CLK_OUT: P2.1 ; off-sheet CLK_OUT
CON_RS485_A: J9.3 R66.2 R68.2 U10.6(A) ; off-sheet CON_RS485_A
CON_RS485_B: J9.1 R64.1 R65.1 U10.7(B) ; off-sheet CON_RS485_B
CS: P2.7 ; off-sheet CS
INT: P2.2 ; off-sheet INT
RST: P2.8 ; off-sheet RST
SCK: P2.6 ; off-sheet SCK
SI: P2.5 ; off-sheet SI
SO: P2.4 ; off-sheet SO
uC_CAN_RxD: T32.1 U9.4(CAN_RxD) ; off-sheet uC_CAN_RxD
uC_CAN_TxD: T31.1 U9.1(CAN_TxD) ; off-sheet uC_CAN_TxD
uC_COM_Direction: R67.2 T34.1 U10.2(~{RE}) U10.3(DE) ; off-sheet uC_COM_Direction
uC_RxD: T33.1 U10.1(RO) ; off-sheet uC_RxD
uC_Silent_Mode: U9.8(S) ; off-sheet uC_Silent_Mode
uC_TxD: T35.1 U10.4(DI) ; off-sheet uC_TxD
VCC_3.3V: C39.1 C40.2 P2.9 R68.1 U9.5(NC) U10.8(VCC) ; off-sheet VCC_3.3V
VCC_5V: C36.1 C37.1 U9.3(VCC) ; off-sheet VCC_5V
WOL: P2.3 ; off-sheet WOL
NetC38_1: C38.1 R62.2 R63.1
NetC41_1: C41.1 R65.2 R66.1

### Notes on the sheet
- (near J8) CAN Connector
- (near U10) GREEN
- (near U10) YELLOW
- (near J9) RS484 Connector

### Library data of the parts
C36-C41 = CAP_SMD: Manufacturer: Vishay
J8 = Phonix_2_Pin
J9 = Phonix_3_Pin
P2 = Header 5X2: Header, 5-Pin, Dual row; LatestRevisionDate: 17-Jul-2002; LatestRevisionNote: Re-released for DXP Platform.; Publisher: Altium Limited
R62-R68 = RES_SMD: as R2 on sheet PG01_Power_Supply
T31-T35 = TestPoint_TH: Value: TP
U9 = NCV7351: Manufacturer: Onsemi; SPN: *
U10 = MAX485: Manufacturer: Maxim

## Sheet PG05_DSP_Circuit.SchDoc
size A3
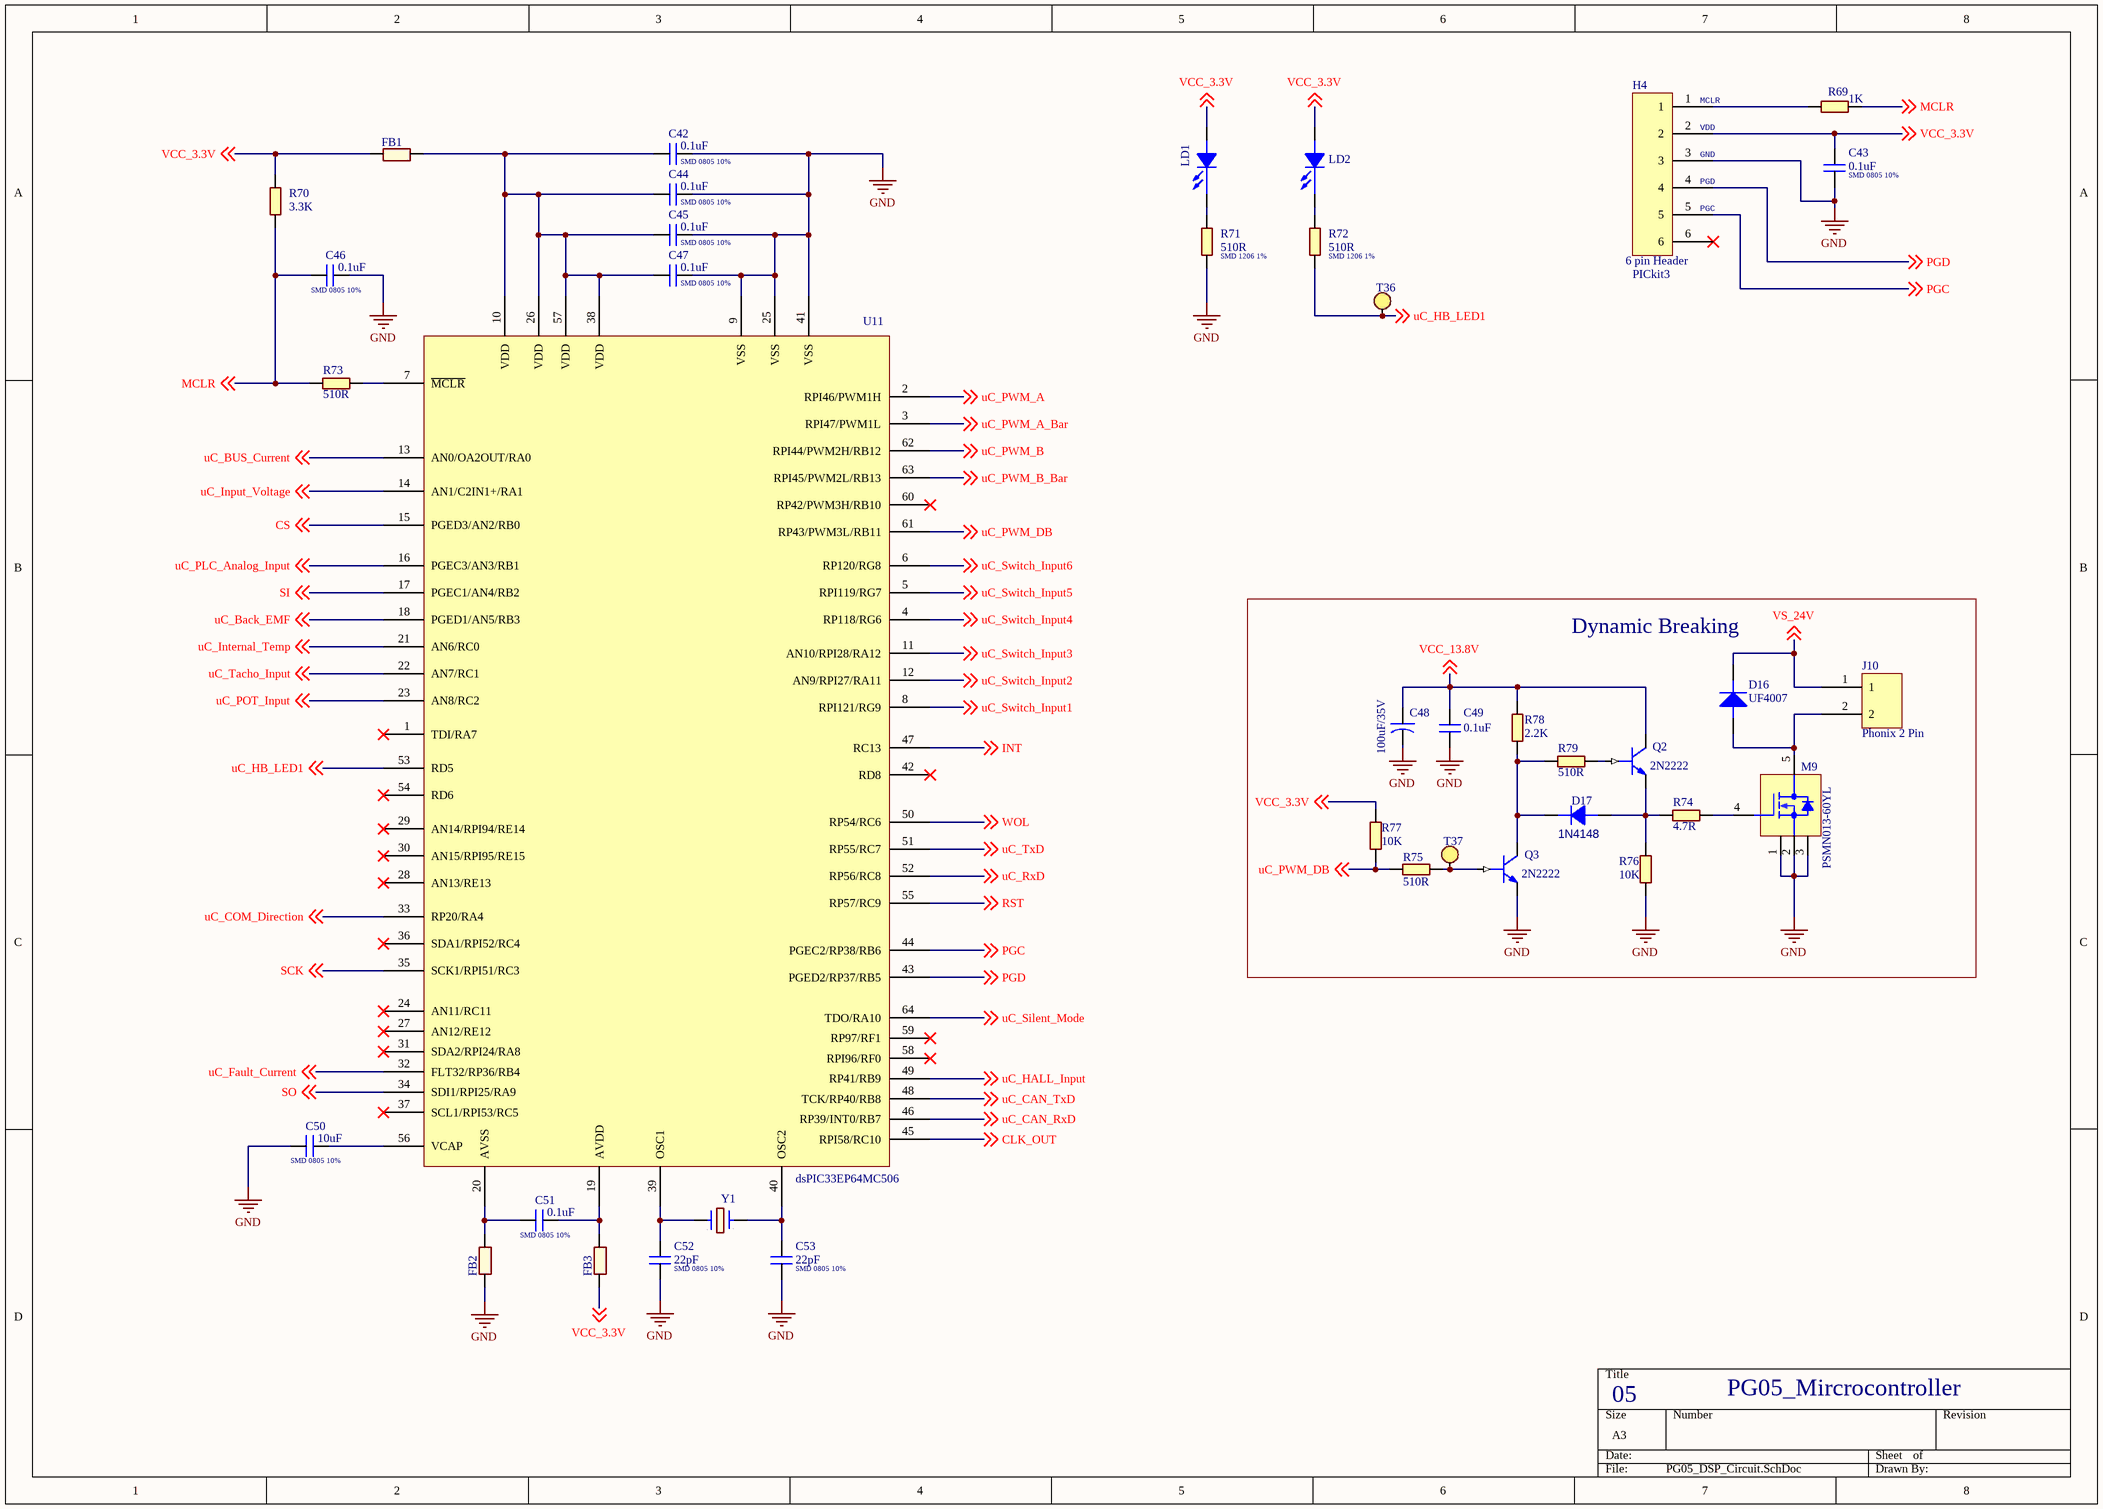
[diagram p4: PG05_DSP_Circuit.SchDoc]

### Parts
C42  SMD 0805 10%  value 0.1uF  [SMD0805]
C43  SMD 0805 10%  value 0.1uF  [SMD0805]
C44  SMD 0805 10%  value 0.1uF  [SMD0805]
C45  SMD 0805 10%  value 0.1uF  [SMD0805]
C46  SMD 0805 10%  value 0.1uF  [SMD0805]
C47  SMD 0805 10%  value 0.1uF  [SMD0805]
C48  value 100uF/35V  [CAP_8mm]  (hidden comment: Cap 5mm radial)
C49  value 0.1uF  [SMD0805]  (hidden comment: SMD 0805 10%)
C50  SMD 0805 10%  value 10uF  [SMD0805]
C51  SMD 0805 10%  value 0.1uF  [SMD0805]
C52  SMD 0805 10%  value 22pF  [SMD0805]
C53  SMD 0805 10%  value 22pF  [SMD0805]
D16  value UF4007  [DO-214(SMA)]  (hidden comment: Diode SMA)
D17  1N4148  [SOD-80]
FB1  Ferrite Bead  [SMD0805]  (value not drawn)
FB2  Ferrite Bead  [SMD0805]  (value not drawn)
FB3  Ferrite Bead  [SMD0805]  (value not drawn)
H4  PICkit3  value 6 pin Header  [Header1x6]
J10  Phonix 2 Pin  [PHONIX2]
LD1  LED  [LED]  (value not drawn)
LD2  LED  [LED]  (value not drawn)
M9  value PSMN013-60YL  [SO8-L]  (hidden comment: N MOSFET)
Q2  value 2N2222  [SOT23-3-Leads]  (hidden comment: SMD NPN BJT)
Q3  value 2N2222  [SOT23-3-Leads]  (hidden comment: SMD NPN BJT)
R69  value 1K  [SMD1206]  (hidden comment: SMD 1206 1%)
R70  value 3.3K  [SMD1206]  (hidden comment: SMD 1206 1%)
R71  SMD 1206 1%  value 510R  [SMD1206]
R72  SMD 1206 1%  value 510R  [SMD1206]
R73  value 510R  [SMD1206]  (hidden comment: SMD 1206 1%)
R74  value 4.7R  [SMD1206]  (hidden comment: SMD 1206 1%)
R75  value 510R  [SMD1206]  (hidden comment: SMD 1206 1%)
R76  value 10K  [SMD1206]  (hidden comment: SMD 1206 1%)
R77  value 10K  [SMD1206]  (hidden comment: SMD 1206 1%)
R78  value 2.2K  [SMD1206]  (hidden comment: SMD 1206 1%)
R79  value 510R  [SMD1206]  (hidden comment: SMD 1206 1%)
T36  Through hole TestPoint  [TP]  (value not drawn)
T37  Through hole TestPoint  [TP]  (value not drawn)
U11  value dsPIC33EP64MC506  [Quad64]  (hidden comment: DSP)
Y1  7.3728MHz  [XTAL]  (value not drawn)

### Blocks framed on the sheet
Dynamic Breaking: C48 C49 D16 D17 J10 M9 Q2 Q3 R74-R79 T37

### Nets
GND: C42.2 C43.1 C44.2 C45.2 C46.2 C47.2 C48.2 C49.2 C50.1 C52.1 C53.1 FB2.2 H4.3 M9.1 M9.2 M9.3 Q3.2(EMITTER) R71.2 R76.2 U11.9(VSS) U11.25(VSS) U11.41(VSS)
CLK_OUT: U11.45(RPI58/RC10) ; off-sheet CLK_OUT
CS: U11.15(PGED3/AN2/RB0) ; off-sheet CS
INT: U11.47(RC13) ; off-sheet INT
MCLR: C46.1 R69.1 R70.1 R73.2 ; off-sheet MCLR
PGC: H4.5 U11.44(PGEC2/RP38/RB6) ; off-sheet PGC
PGD: H4.4 U11.43(PGED2/RP37/RB5) ; off-sheet PGD
RST: U11.55(RP57/RC9) ; off-sheet RST
SCK: U11.35(SCK1/RPI51/RC3) ; off-sheet SCK
SI: U11.17(PGEC1/AN4/RB2) ; off-sheet SI
SO: U11.34(SDI1/RPI25/RA9) ; off-sheet SO
uC_Back_EMF: U11.18(PGED1/AN5/RB3) ; off-sheet uC_Back_EMF
uC_BUS_Current: U11.13(AN0/OA2OUT/RA0) ; off-sheet uC_BUS_Current
uC_CAN_RxD: U11.46(RP39/INT0/RB7) ; off-sheet uC_CAN_RxD
uC_CAN_TxD: U11.48(TCK/RP40/RB8) ; off-sheet uC_CAN_TxD
uC_COM_Direction: U11.33(RP20/RA4) ; off-sheet uC_COM_Direction
uC_Fault_Current: U11.32(FLT32/RP36/RB4) ; off-sheet uC_Fault_Current
uC_HALL_Input: U11.49(RP41/RB9) ; off-sheet uC_HALL_Input
uC_HB_LED1: R72.2 T36.1 U11.53(RD5) ; off-sheet uC_HB_LED1
uC_Input_Voltage: U11.14(AN1/C2IN1+/RA1) ; off-sheet uC_Input_Voltage
uC_Internal_Temp: U11.21(AN6/RC0) ; off-sheet uC_Internal_Temp
uC_PLC_Analog_Input: U11.16(PGEC3/AN3/RB1) ; off-sheet uC_PLC_Analog_Input
uC_POT_Input: U11.23(AN8/RC2) ; off-sheet uC_POT_Input
uC_PWM_A: U11.2(RPI46/PWM1H) ; off-sheet uC_PWM_A
uC_PWM_A_Bar: U11.3(RPI47/PWM1L) ; off-sheet uC_PWM_A_Bar
uC_PWM_B: U11.62(RPI44/PWM2H/RB12) ; off-sheet uC_PWM_B
uC_PWM_B_Bar: U11.63(RPI45/PWM2L/RB13) ; off-sheet uC_PWM_B_Bar
uC_PWM_DB: R75.1 R77.1 U11.61(RP43/PWM3L/RB11) ; off-sheet uC_PWM_DB
uC_RxD: U11.52(RP56/RC8) ; off-sheet uC_RxD
uC_Silent_Mode: U11.64(TDO/RA10) ; off-sheet uC_Silent_Mode
uC_Switch_Input1: U11.8(RPI121/RG9) ; off-sheet uC_Switch_Input1
uC_Switch_Input2: U11.12(AN9/RPI27/RA11) ; off-sheet uC_Switch_Input2
uC_Switch_Input3: U11.11(AN10/RPI28/RA12) ; off-sheet uC_Switch_Input3
uC_Switch_Input4: U11.4(RP118/RG6) ; off-sheet uC_Switch_Input4
uC_Switch_Input5: U11.5(RPI119/RG7) ; off-sheet uC_Switch_Input5
uC_Switch_Input6: U11.6(RP120/RG8) ; off-sheet uC_Switch_Input6
uC_Tacho_Input: U11.22(AN7/RC1) ; off-sheet uC_Tacho_Input
uC_TxD: U11.51(RP55/RC7) ; off-sheet uC_TxD
VCC_3.3V: C43.2 FB1.2 FB3.2 H4.2 LD1.1(ANODE) LD2.1(ANODE) R70.2 R77.2 ; off-sheet VCC_3.3V
VCC_13.8V: C48.1 C49.1 Q2.3(COLLECTOR) R78.1 ; off-sheet VCC_13.8V
VS_24V: D16.2 J10.1 ; off-sheet VS_24V
WOL: U11.50(RP54/RC6) ; off-sheet WOL
NetC42_1: C42.1 C44.1 C45.1 C47.1 FB1.1 U11.10(VDD) U11.26(VDD) U11.38(VDD) U11.57(VDD)
NetC50_2: C50.2 U11.56(VCAP)
NetC51_1: C51.1 FB2.1 U11.20(AVSS)
NetC51_2: C51.2 FB3.1 U11.19(AVDD)
NetC52_2: C52.2 U11.39(OSC1) Y1.1
NetC53_2: C53.2 U11.40(OSC2) Y1.2
NetD16_1: D16.1 J10.2 M9.5
NetD17_1: D17.1(ANODE) Q2.2(EMITTER) R74.2 R76.1
NetD17_2: D17.2(CATHODE) Q3.3(COLLECTOR) R78.2 R79.1
NetH4_1: H4.1 R69.2
NetLD1_2: LD1.2(CATHODE) R71.1
NetLD2_2: LD2.2(CATHODE) R72.1
NetM9_4: M9.4(G) R74.1
NetQ2_1: Q2.1(BASE) R79.2
NetQ3_1: Q3.1(BASE) R75.2 T37.1
NetR73_1: R73.1 U11.7(~{MCLR})

Not connected (* = marked no-connect by the designer): H4 6*; U11 1(TDI/RA7)* 24(AN11/RC11)* 27(AN12/RE12)* 28(AN13/RE13)* 29(AN14/RPI94/RE14)* 30(AN15/RPI95/RE15)* 31(SDA2/RPI24/RA8)* 36(SDA1/RPI52/RC4)* 37(SCL1/RPI53/RC5)* 42(RD8)* 54(RD6)* 58(RPI96/RF0)* 59(RP97/RF1)* 60(RP42/PWM3H/RB10)*

### Notes on the sheet
- (near H4) MCLR
- (near H4) GND
- (near H4) PGD
- (near H4) VDD
- (near H4) PGC
- PG05_Mircrocontroller
- 05

### Library data of the parts
C42-C47 C49-C53 = CAP_SMD: Manufacturer: Vishay
C48 = CAP_Electolytic_5mm: Manufacturer: Nichicon
D16 = Diode_SMA: Manufacturer: Diodes Corp
D17 = 1N4148: as D4 on sheet PG01_Power_Supply; Rating: -; Temp. Coeff.: -; Termination: -; Marking: -; Category: Diode
FB1-FB3 = R_3: Manufacturer: Vishay Semiconductors; Source Of Supply: Rajiv Electronics,Pune; Type: Component; Value: Bead Ferrite
H4 = Header_6_Pin
J10 = Phonix_2_Pin
LD1 LD2 = LED: Manufacturer: Rajeev; Value: Red LED Through hole
M9 = MOS_PSMN013-60YL: Manufacturer: NxP
Q2 Q3 = 2N3904_1: Manufacturer: OnSemi
R69-R79 = RES_SMD: as R2 on sheet PG01_Power_Supply
T36 T37 = TestPoint_TH: Value: TP
U11 = dsPIC33EP64MC506: Manufacturer: Microchip
Y1 = Crystal

## Nets that join several sheets
GND: PG01_Power_Supply (19 pins), PG02_Full_Bridge (20 pins), PG03_Analog_Digital_Inputs (27 pins), PG04_Communications (12 pins), PG05_DSP_Circuit (22 pins)
BEMF_A: PG01_Power_Supply (R6.2 R10.1), PG02_Full_Bridge (10 pins)
BEMF_B: PG01_Power_Supply (R7.1 R8.2), PG02_Full_Bridge (10 pins)
CLK_OUT: PG04_Communications (P2.1), PG05_DSP_Circuit (U11.45)
CS: PG04_Communications (P2.7), PG05_DSP_Circuit (U11.15)
INT: PG04_Communications (P2.2), PG05_DSP_Circuit (U11.47)
RST: PG04_Communications (P2.8), PG05_DSP_Circuit (U11.55)
SCK: PG04_Communications (P2.6), PG05_DSP_Circuit (U11.35)
SI: PG04_Communications (P2.5), PG05_DSP_Circuit (U11.17)
SO: PG04_Communications (P2.4), PG05_DSP_Circuit (U11.34)
uC_Back_EMF: PG01_Power_Supply (C11.1 R9.2 T4.1), PG05_DSP_Circuit (U11.18)
uC_BUS_Current: PG02_Full_Bridge (R33.1 T17.1), PG05_DSP_Circuit (U11.13)
uC_CAN_RxD: PG04_Communications (T32.1 U9.4), PG05_DSP_Circuit (U11.46)
uC_CAN_TxD: PG04_Communications (T31.1 U9.1), PG05_DSP_Circuit (U11.48)
uC_COM_Direction: PG04_Communications (R67.2 T34.1 U10.2 U10.3), PG05_DSP_Circuit (U11.33)
uC_Fault_Current: PG02_Full_Bridge (Q1.3 R36.1 T18.1), PG05_DSP_Circuit (U11.32)
uC_HALL_Input: PG03_Analog_Digital_Inputs (C29.1 R44.1 T20.1), PG05_DSP_Circuit (U11.49)
uC_Input_Voltage: PG03_Analog_Digital_Inputs (C31.1 R46.1 T22.1), PG05_DSP_Circuit (U11.14)
uC_Internal_Temp: PG03_Analog_Digital_Inputs (C30.1 R45.1 T21.1), PG05_DSP_Circuit (U11.21)
uC_PLC_Analog_Input: PG03_Analog_Digital_Inputs (C34.2 R55.1 R58.2 T26.1), PG05_DSP_Circuit (U11.16)
uC_POT_Input: PG03_Analog_Digital_Inputs (C28.1 R43.1 T19.1), PG05_DSP_Circuit (U11.23)
uC_PWM_A: PG02_Full_Bridge (R21.2), PG05_DSP_Circuit (U11.2)
uC_PWM_A_Bar: PG02_Full_Bridge (R22.2), PG05_DSP_Circuit (U11.3)
uC_PWM_B: PG02_Full_Bridge (R23.2), PG05_DSP_Circuit (U11.62)
uC_PWM_B_Bar: PG02_Full_Bridge (R24.2), PG05_DSP_Circuit (U11.63)
uC_RxD: PG04_Communications (T33.1 U10.1), PG05_DSP_Circuit (U11.52)
uC_Silent_Mode: PG04_Communications (U9.8), PG05_DSP_Circuit (U11.64)
uC_Switch_Input1: PG03_Analog_Digital_Inputs (R48.1), PG05_DSP_Circuit (U11.8)
uC_Switch_Input2: PG03_Analog_Digital_Inputs (R49.1), PG05_DSP_Circuit (U11.12)
uC_Switch_Input3: PG03_Analog_Digital_Inputs (R50.1), PG05_DSP_Circuit (U11.11)
uC_Switch_Input4: PG03_Analog_Digital_Inputs (R53.1), PG05_DSP_Circuit (U11.4)
uC_Switch_Input5: PG03_Analog_Digital_Inputs (R56.1), PG05_DSP_Circuit (U11.5)
uC_Switch_Input6: PG03_Analog_Digital_Inputs (R59.1), PG05_DSP_Circuit (U11.6)
uC_Tacho_Input: PG03_Analog_Digital_Inputs (6 pins), PG05_DSP_Circuit (U11.22)
uC_TxD: PG04_Communications (T35.1 U10.4), PG05_DSP_Circuit (U11.51)
VCC_3.3V: PG01_Power_Supply (5 pins), PG02_Full_Bridge (R36.2), PG03_Analog_Digital_Inputs (C32.1 D14.2 P1.1 R42.2), PG04_Communications (6 pins), PG05_DSP_Circuit (8 pins)
VCC_5V: PG01_Power_Supply (6 pins), PG02_Full_Bridge (C26.1 U7.8), PG03_Analog_Digital_Inputs (R39.2 R41.1 R52.1 R54.1), PG04_Communications (C36.1 C37.1 U9.3)
VCC_13.8V: PG01_Power_Supply (9 pins), PG02_Full_Bridge (8 pins), PG03_Analog_Digital_Inputs (C33.1 U8.8), PG05_DSP_Circuit (C48.1 C49.1 Q2.3 R78.1)
VS_24V: PG01_Power_Supply (D2.1 J1.1 J1.2), PG02_Full_Bridge (5 pins), PG03_Analog_Digital_Inputs (R40.2), PG05_DSP_Circuit (D16.2 J10.1)
WOL: PG04_Communications (P2.3), PG05_DSP_Circuit (U11.50)